# EAGLE design lcd_i2c (EAGLE 6.0)
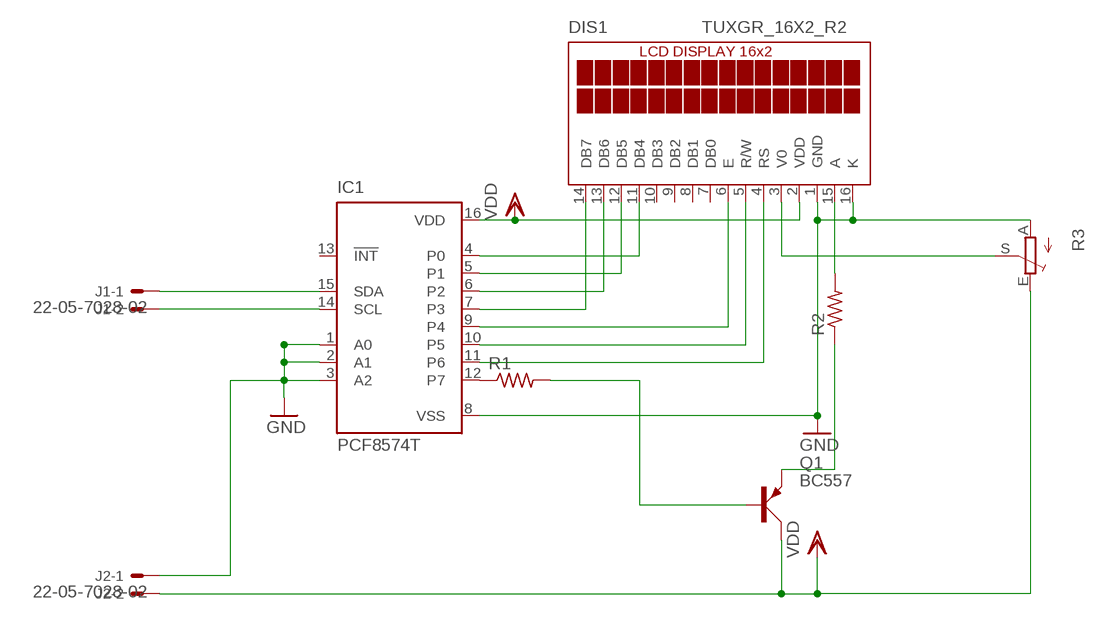
[diagram p0: schematic, sheet 1]

## Parts
DIS1  TUXGR_16X2_R2  [TUXGR_16X2_R2]
IC1  PCF8574T  [SO16W]
J1  22-05-7028-02  [7395-02]
J2  22-05-7028-02  [7395-02]
Q1  BC557  [SOT54A]
R1  R-US_0207/7  [0207/7]
R2  R-US_0207/7  [0207/7]
R3  TRIM_EU-B25X  [B25X]

## Nets
GND: DIS1.1(GND) DIS1.16(K) IC1.1(A0) IC1.2(A1) IC1.3(A2) IC1.8(VSS) J2.1 R3.A
N$1: DIS1.15(A) R2.2
N$2: DIS1.3(V0) R3.S
N$3: DIS1.11(DB4) IC1.4(P0)
N$4: DIS1.12(DB5) IC1.5(P1)
N$5: DIS1.13(DB6) IC1.6(P2)
N$6: DIS1.14(DB7) IC1.7(P3)
N$7: DIS1.6(E) IC1.9(P4)
N$8: DIS1.5(R/W) IC1.10(P5)
N$9: DIS1.4(RS) IC1.11(P6)
N$10: IC1.12(P7) R1.1
N$11: Q1.E R2.1
N$12: IC1.14(SCL) J1.2
N$13: Q1.B R1.2
N$14: IC1.15(SDA) J1.1
VDD: DIS1.2(VDD) IC1.16(VDD) J2.2 Q1.C R3.E
Unconnected: DIS1.7(DB0) DIS1.8(DB1) DIS1.9(DB2) DIS1.10(DB3) IC1.13(!INT)

## Library data of the parts
DIS1 = display-lcd2:TUXGR_16X2_R2: Tuxgraphics LCD display 16x2 characters reflective, without background light Source: tuxgr_12x2_r2.pdf; OC_FARNELL: unknown; OC_NEWARK: unknown
IC1 = micro-philips:PCF8574: I2C-Bus Remote 8-bit I/O expander http://www.semiconductors.philips.com/acrobat_download/datasheets/PCF8574_4.pdf; MPN: PCF8574T/3,512; OC_FARNELL: 1201255; OC_NEWARK: 70R6870
J1 J2 = con-molex:22-?-02: CONNECTOR wire to board 2.54 mm (.1 inch) pitch header; OC_FARNELL: 9731601; OC_NEWARK: unknown
Q1 = transistor-small-signal:BC557: PNP TRANSISTOR
R1 R2 = resistor:R-US_: RESISTOR, American symbol
R3 = pot:TRIM_EU-: POTENTIOMETER

## Board
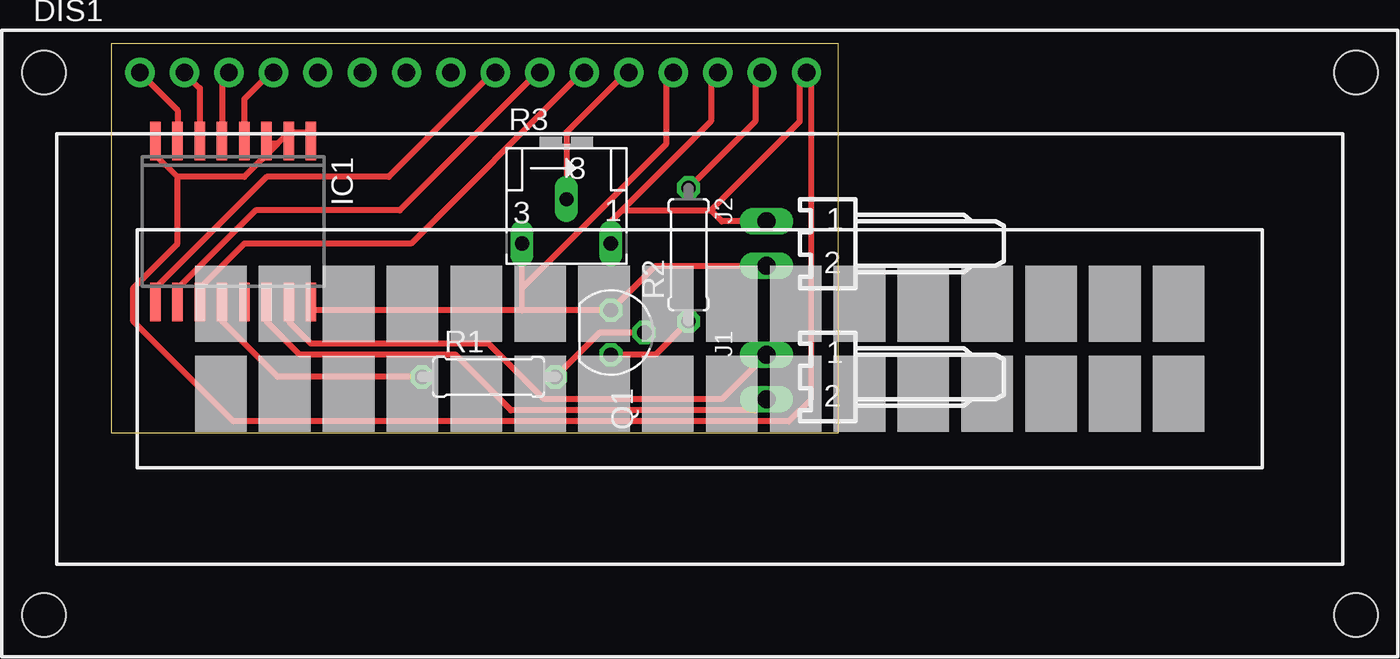
[diagram p1: board, top side]

Size 41.58 x 22.21 mm. Coordinates in mm from the lower left corner, seen from the top.
Outline: 0,0 41.58,0 41.58,22.21 0,22.21 0,0
Copper layers 1: Top 0.035mm
Design rules: minimum track width 14mil, minimum drill 24mil, track to track 8mil, track to pad 8mil, pad to pad 8mil, via to via 8mil, smd to smd 8mil, copper to edge 25mil, drill to drill 8mil, minimum pad ring 10mil, minimum via ring 8mil, stop-mask expansion 4mil, vias tented up to drill 0mil, thermal gap 10mil

### Footprints (pad centres in the part's own frame; a part is rotated, then mirrored left to right if it is on the bottom)
TUXGR_16X2_R2 = drill 1 pad 1.676: 1 1.02,15.5; 2 -1.52,15.5; 3 -4.06,15.5; 4 -6.6,15.5; 5 -9.14,15.5; 6 -11.68,15.5; 7 -14.22,15.5; 8 -16.76,15.5; 9 -19.3,15.5; 10 -21.84,15.5; 11 -24.38,15.5; 12 -26.92,15.5; 13 -29.46,15.5; 14 -32,15.5; 15 3.56,15.5; 16 6.1,15.5 | hole 2.5: -37.5,-15.5; 37.5,-15.5; -37.5,15.5; 37.5,15.5
SO16W = smd 0.6 x 2.2: 1 -4.445,-4.6; 2 -3.175,-4.6; 3 -1.905,-4.6; 4 -0.635,-4.6; 5 0.635,-4.6; 6 1.905,-4.6; 7 3.175,-4.6; 8 4.445,-4.6; 9 4.445,4.6; 10 3.175,4.6; 11 1.905,4.6; 12 0.635,4.6; 13 -0.635,4.6; 14 -1.905,4.6; 15 -3.175,4.6; 16 -4.445,4.6
7395-02 = drill 1.016 long: 1 1.27,0; 2 -1.27,0
SOT54A = drill 0.813 octagon: B 0,1.905; C -1.27,0; E 1.27,0
0207/7 = drill 0.813 octagon: 1 -3.81,0; 2 3.81,0
B25X = drill 0.813 long: A 2.54,-1.905; E -2.54,-1.905; S 0,0.635

### Placement (x,y rotation side)
DIS1  33.66,5.08 0 top
IC1  6.99,12.06 180 top
J1  37.47,3.17 90 top
J2  37.47,10.79 90 top
Q1  28.57,5.71 270 top
R1  21.59,3.17 0 top
R2  33.02,10.16 90 top
R3  26.04,12.7 0 top

### Tracks (layer width: path | path; a pad name or v marks a point on that pad's centre or on a via)
GND
  Top 0.356: IC1.8 2.54,15.88 3.81,14.61 | 3.81,14.61 7.62,14.61 9.53,16.51 | 10.16,17.14 9.53,16.51 | 9.53,16.51 8.89,16.51 IC1.3 | 10.16,17.14 11.43,17.14 IC1.1 | 10.16,17.14 IC1.2 | R3.A 28.57,12.06 29.21,12.7 | 29.21,12.7 34.29,17.78 34.29,20.32 DIS1.1 | 34.29,12.7 39.37,17.78 39.37,20.32 DIS1.16 40.01,20.32 40.01,1.91 38.73,0.64 6.99,0.64 1.27,6.35 1.27,8.26 3.81,10.79 3.81,14.61 | 29.21,12.7 34.29,12.7 | J2.1 34.92,12.06 34.29,12.7
N$1
  Top 0.356: R2.2 36.83,17.78 36.83,20.32 DIS1.15
N$2
  Top 0.356: R3.S 26.04,17.14 29.21,20.32 DIS1.3
N$3
  Top 0.356: IC1.4 7.62,19.05 8.89,20.32 DIS1.11
N$4
  Top 0.356: IC1.5 6.35,20.32 DIS1.12
N$5
  Top 0.356: IC1.6 5.08,19.68 4.45,20.32 DIS1.13
N$6
  Top 0.356: IC1.7 3.81,18.41 1.91,20.32 DIS1.14
N$7
  Top 0.356: IC1.9 2.54,8.26 8.89,14.61 15.88,14.61 21.59,20.32 DIS1.6
N$8
  Top 0.356: IC1.10 3.81,8.26 8.26,12.7 16.51,12.7 24.13,20.32 DIS1.5
N$9
  Top 0.356: IC1.11 5.08,8.26 7.62,10.79 17.14,10.79 26.67,20.32 DIS1.4
N$10
  Top 0.356: IC1.12 6.35,6.35 9.53,3.17 R1.1
N$11
  Top 0.356: Q1.E 31.11,4.45 R2.1
N$12
  Top 0.356: IC1.14 8.89,6.35 10.79,4.45 19.68,4.45 22.86,1.27 36.83,1.27 J1.2
N$13
  Top 0.356: R1.2 27.94,5.71 Q1.B
N$14
  Top 0.356: IC1.15 10.16,6.35 11.43,5.08 21.59,5.08 24.77,1.91 34.92,1.91 J1.1
VDD
  Top 0.356: 23.5,6.99 Q1.C 31.11,9.53 J2.2 | 23.5,6.99 11.43,6.99 IC1.16 | 23.5,6.99 23.5,8.26 | 23.5,8.26 R3.E | 23.5,8.26 31.75,16.51 31.75,20.32 DIS1.2